# Altium schematic sheet MEMS Microphone Module.SchDoc
size A4
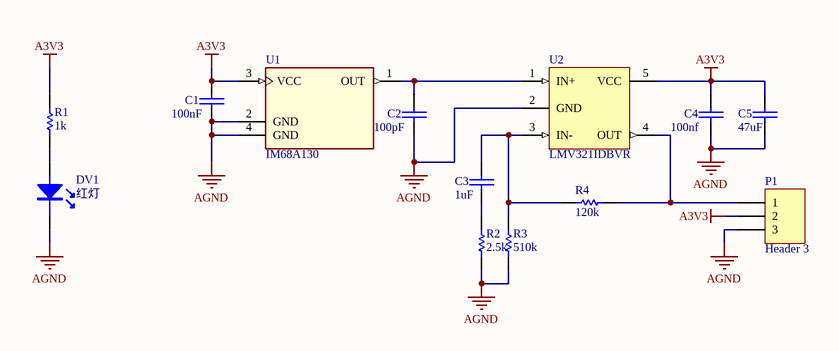
[diagram p0: MEMS Microphone Module.SchDoc]

## Parts
C1  100nF  [0603C]
C2  100pF  [0603C]
C3  1uF  [0603C]
C4  100nf  [0603C]
C5  47uF  [0603C]
DV1  红灯  [LQ_LED0603R]
P1  Header 3  [HDR1X3]
R1  1k  [0603R]
R2  2.5k  [0603R]
R3  510k  [0603R]
R4  120k  [0603R]
U1  IM68A130  [IM68A130]
U2  LMV321IDBVR  [LQ_SOT-23-5]

## Nets
A3V3: C1.2 C4.2 C5.2 P1.2 R1.2 U1.3(VCC) U2.5(VCC)
AGND: C1.1 C2.1 C4.1 C5.1 DV1.2 P1.3 R2.1 R3.1 U1.2(GND) U1.4(GND) U2.2(GND)
NetC2_2: C2.2 U1.1(OUT) U2.1(IN+)
NetC3_1: C3.1 R2.2
NetC3_2: C3.2 R3.2 R4.1 U2.3(IN-)
NetDV1_1: DV1.1 R1.1
NetP1_1: P1.1 R4.2 U2.4(OUT)

## Library data of the parts
C1-C5 = CAP: 无极性电容
DV1 = LQ_LED
P1 = Header 3: Header, 3-Pin; LatestRevisionDate: 17-Jul-2002; LatestRevisionNote: Re-released for DXP Platform.; Publisher: Altium Limited
R1-R4 = RES
U1 = IM68A130: High Performance Digital XENSIV MEMS Microphone; ManufacturerPartNumber: IM69D130; Manufacturer: Infineon Technologies; PackageReference: PG-LLGA-5-1
U2 = LMV321IDBVR: LMV321ID